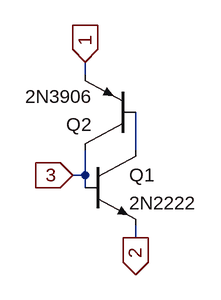
[diagram p0: schematic LT_524x.asc]
LT_524x.asc, the LTspice schematic file:
Version 4
SHEET 1 880 680
WIRE 160 144 160 128
WIRE 224 240 224 192
WIRE 160 272 160 240
WIRE 160 272 144 272
WIRE 160 288 160 272
WIRE 224 352 224 336
FLAG 160 128 1
IOPIN 160 128 In
FLAG 144 272 3
IOPIN 144 272 In
FLAG 224 352 2
IOPIN 224 352 Out
SYMBOL npn 160 240 R0
SYMATTR InstName Q1
SYMATTR Value 2N2222
SYMBOL pnp 224 240 R180
SYMATTR InstName Q2
SYMATTR Value 2N3906

The netlist it stands for:
* LT_524x.asc
Q1 N001 3 2 0 2N2222
Q2 3 N001 1 0 2N3906
.model NPN NPN
.model PNP PNP
.lib standard.bjt
.backanno
.end